# Altium schematic sheet oled.SchDoc
size A4; SheetNumber: 2; SheetTotal: 2
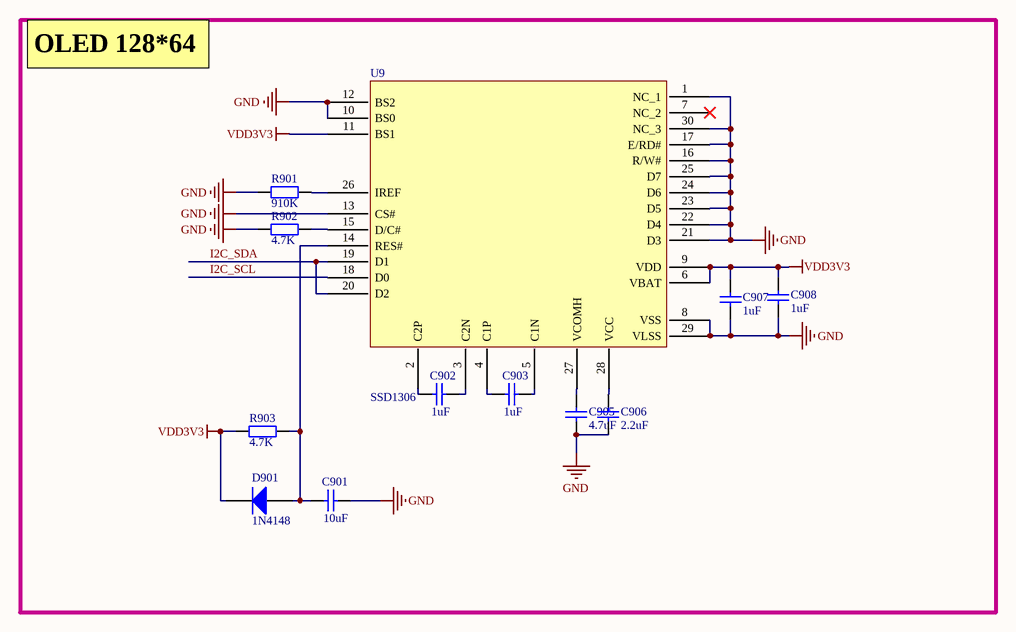
[diagram p0: oled.SchDoc]

## Parts
C901  10uF  [0603_CAP]
C902  1uF  [0603_CAP]
C903  1uF  [0603_CAP]
C905  4.7uF  [0603_CAP]
C906  2.2uF  [0603_CAP]
C907  1uF  [0603_CAP]
C908  1uF  [0603_CAP]
D901  1N4148  [SOD-323]
R901  910K  [0603_CAP]
R902  4.7K  [0603_CAP]
R903  4.7K  [0603_CAP]
U9  SSD1306  [SSD1306]

## Nets
GND: C901.2 C905.1 C906.1 C907.1 C908.1 R901.2 R902.2 U9.1(NC_1) U9.8(VSS) U9.10(BS0) U9.12(BS2) U9.13(CS#) U9.16(R/W#) U9.17(E/RD#) U9.21(D3) U9.22(D4) U9.23(D5) U9.24(D6) U9.25(D7) U9.29(VLSS) U9.30(NC_3)
VDD3V3: C907.2 C908.2 D901.2(K) R903.2 U9.6(VBAT) U9.9(VDD) U9.11(BS1)
I2C_SCL: U9.18(D0)
I2C_SDA: U9.19(D1) U9.20(D2)
NetC901_1: C901.1 D901.1(A) R903.1 U9.14(RES#)
NetC902_1: C902.1 U9.2(C2P)
NetC902_2: C902.2 U9.3(C2N)
NetC903_1: C903.1 U9.4(C1P)
NetC903_2: C903.2 U9.5(C1N)
NetC905_2: C905.2 U9.27(VCOMH)
NetC906_2: C906.2 U9.28(VCC)
NetR901_1: R901.1 U9.26(IREF)
NetR902_1: R902.1 U9.15(D/C#)

Not connected (* = marked no-connect by the designer): U9 7(NC_2)*

## Notes on the sheet
- OLED 128*64 pixel

## Library data of the parts
C901-C903 C905-C908 = Cap: Capacitor 0603; Published: 8-Jun-2000; LatestRevisionDate: 17-Jul-2002; LatestRevisionNote: Re-released for DXP Platform.; PackageReference: RAD-0.3; Publisher: Altium Limited; PackageDescription: Radial Cap, Thru-Hole; 2 Leads; 0.3 in Pin Spacing
D901 = Diode: IN4148 0805 SOD323; Published: 8-Jun-2000; LatestRevisionDate: 17-Jul-2002; LatestRevisionNote: Re-released for DXP Platform.; PackageVersion: Sep-1996; PackageReference: SMC; Publisher: Altium Limited; PackageDescription: DO-214-AB/SMC; 2 C-Bend Leads; Body 7.9 x 5.9 mm, inc. leads (LxW); Code_JEDEC: DO-214-AB
R901-R903 = Res2: Resistor 0603; Published: 8-Jun-2000; LatestRevisionDate: 17-Jul-2002; LatestRevisionNote: Re-released for DXP Platform.; PackageReference: AXIAL-0.4; Publisher: Altium Limited